# Altium schematic sheet SCH_MAX31865.SchDoc
size A
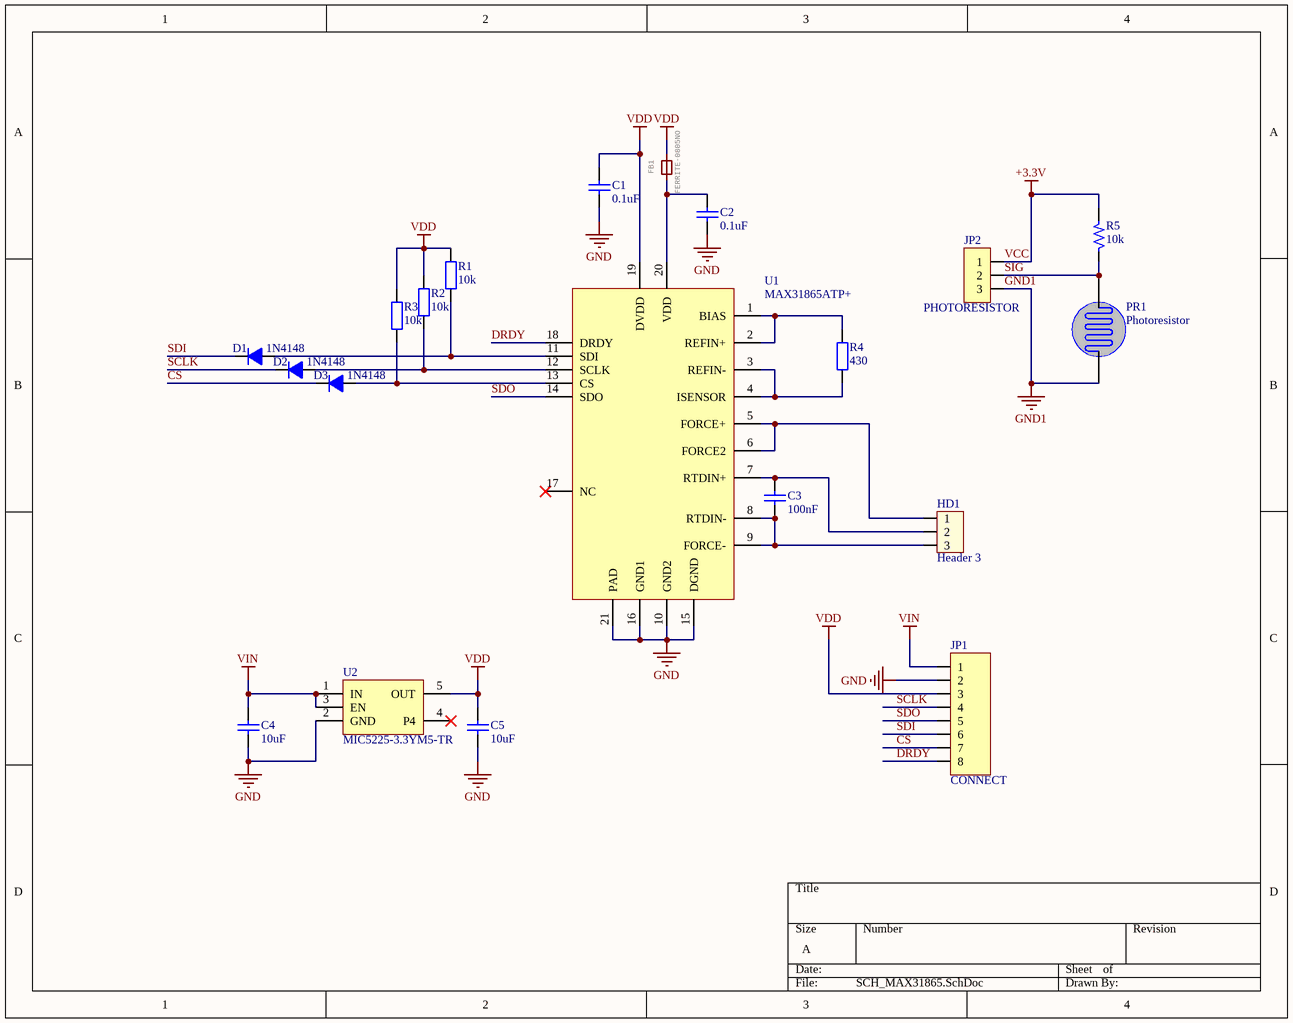
[diagram p0: SCH_MAX31865.SchDoc]

## Parts
C1  0.1uF  [tu 0805]
C2  0.1uF  [tu 0805]
C3  100nF  [tu 0805]
C4  10uF  [tu 0805]
C5  10uF  [tu 0805]
D1  1N4148  [SOD523F]
D2  1N4148  [SOD523F]
D3  1N4148  [SOD523F]
FB1  FERRITE-0805NO  [tu 0805]
HD1  Header 3  [HED3]
JP1  CONNECT  [JP 1x8 DT]
JP2  PHOTORESISTOR  [JP 1x3 DT]
PR1  Photoresistor  [CDS]
R1  10k  [tro smd 0805]
R2  10k  [tro smd 0805]
R3  10k  [tro smd 0805]
R4  430  [tro smd 0805]
R5  10k  [R1/4W]
U1  MAX31865ATP+  [21-0140_T2055+5_MXM]
U2  MIC5225-3.3YM5-TR  [SOT-23-5_M5_MCH]

## Nets
GND: C1.2 C2.2 C4.2 C5.2 JP1.2 U1.10(GND2) U1.15(DGND) U1.16(GND1) U1.21(PAD) U2.2(GND)
GND1: JP2.3 PR1.1
VCC: JP2.1 R5.2  [also labelled +3.3V]
VDD: C1.1 C5.1 FB1.2(P$2) JP1.3 R1.2 R2.2 R3.2 U1.19(DVDD) U2.5(OUT)
VIN: C4.1 JP1.1 U2.1(IN) U2.3(EN)
CS: D3.K JP1.7
DRDY: JP1.8 U1.18(DRDY)
SCLK: D2.K JP1.4
SDI: D1.K JP1.6
SDO: JP1.5 U1.14(SDO)
SIG: JP2.2 PR1.2 R5.1
NetC2_1: C2.1 FB1.1(P$1) U1.20(VDD)
NetC3_1: C3.1 HD1.2 U1.7(RTDIN+)
NetC3_2: C3.2 HD1.3 U1.8(RTDIN-) U1.9(FORCE-)
NetD1_A: D1.A R1.1 U1.11(SDI)
NetD2_A: D2.A R2.1 U1.12(SCLK)
NetD3_A: D3.A R3.1 U1.13(CS)
NetHD1_1: HD1.1 U1.5(FORCE+) U1.6(FORCE2)
NetR4_1: R4.1 U1.3(REFIN-) U1.4(ISENSOR)
NetR4_2: R4.2 U1.1(BIAS) U1.2(REFIN+)

Not connected (* = marked no-connect by the designer): U1 17(NC)*; U2 4(P4)*

## Library data of the parts
C1-C5 = Tu 0805 101 50V 20%: SMD 0603; Chung_Loai: Dán; Don_Vi: Con; So_Chan: 2; Ten_Linh_Kien: Tụ 0805 101-0.1nF 50V 20%; Ma_Hang: MH002806; Kieu_Chan: *
D1-D3 = Diode  1N4007: Diode 1A SMD; Value: 1N4007
FB1 = FERRITE-0805NO: Ferrite Bead   0603 MMZ1608B121C - 120 Ohm @ 100MHz, 600mA, 0.15 Ohm DC Resistance - Digikey: 445-2164-1-ND  BK1608HW121-T - 120 Ohm, 600mA Ferrite Chip - Digikey: 587-1876-2-ND       0805 HZ0805B272R-10 - 2.7K Ohm @ 100MHz, 200mA, 0.8 Ohm DC Resistance - Digikey: 240-2504-1-ND (see also Murata BLM21BD272SN1L)  MMZ2012Y152B - 1.5K Ohm @ 100MHz, 500mA, 0.4 Ohm DC Resistance - Digikey: 445-1560-1-ND - Mainly for high frequency (80-400MHz)  MMZ2012R102A - 1K Ohm @ 100MHz, 500mA, 0.3 Ohm DC Resistance - Digikey: 445-1555-2-ND - More general purpose (10-200MHz); GateName_1: G$1; SymbolName_1: FERRITE; DeviceName: -0805NO; LibraryName: microbuilder; DeviceSetName: FERRITE
HD1 = Header 3: jumper 1x3; Value: Header 3
JP1 = JP 1x8 2.54 Duc Thang: jumper 1x8; Ten_Linh_Kien: Jump Đơn Đực 2.54MM 1x40P Thẳng 11MM; Don_Vi: Con; Ma_Hang: MH000903; Chung_Loai: Cắm; Ghi_Chu: *; Kieu_Chan: *
JP2 = JP 1x3 2.54 Duc Thang: Cắm; Ten_Linh_Kien: Jump Đơn Đực 2.54MM 1x40P Thẳng 11MM; Don_Vi: Con; Ma_Hang: MH000903; Ghi_Chu: *; Kieu_Chan: *; Chung_Loai: Cắm
R1-R3 = Tro 0805 1% 18k: SMD 0603; Chung_Loai: Dán; Don_Vi: Con; So_Chan: 2; Ten_Linh_Kien: Trở 0805 1% 18k; Ma_Hang: MH005477; Kieu_Chan: *
R4 = Tro 0805 1% 18k: SMD 0805; Chung_Loai: Dán; Don_Vi: Con; So_Chan: 2; Ten_Linh_Kien: Trở 0805 1% 18k; Ma_Hang: MH005477; Kieu_Chan: *
R5 = Res: Res cắm
U2 = MIC5225-3.3YM5-TR: No Description Available; Mfr_Name: Microchip; RefDes: RefDes; Type: Type
PR1 = Photoresistor: Creator: Bien Nguyen